# EAGLE schematic untitled (EAGLE 8.2.2)
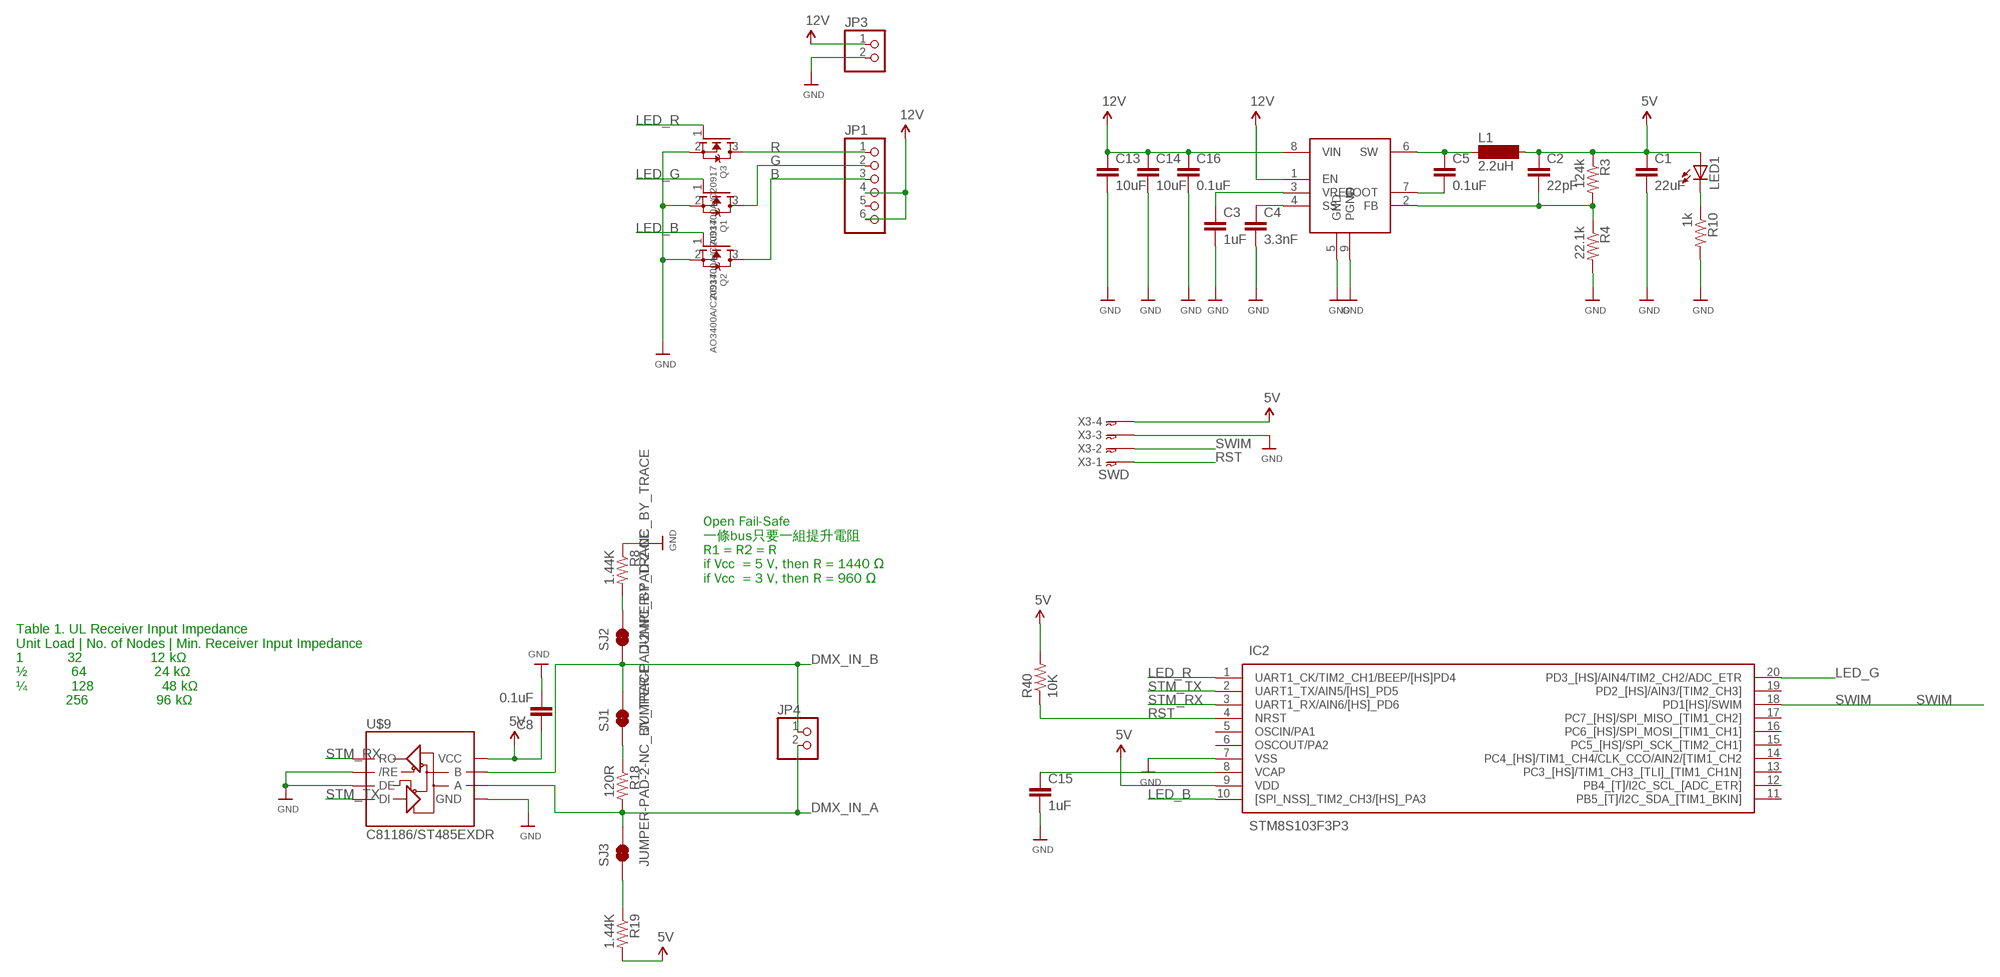
[diagram p0: schematic, sheet 1]

## Parts
C1  22uF  CAPACITOR-0805  [0805-CAP]
C2  22pF  CAPACITOR-0805  [0805-CAP]
C3  1uF  CAPACITOR-0603  [0603-CAP]
C4  3.3nF  CAPACITOR-0603  [0603-CAP]
C5  0.1uF  CAPACITOR-0603  [0603-CAP]
C8  0.1uF  CAPACITOR-0402  [0402-CAP]
C13  10uF  CAPACITOR-0603  [0603-CAP]
C14  10uF  CAPACITOR-0603  [0603-CAP]
C15  1uF  CAPACITOR-0603  [0603-CAP]
C16  0.1uF  CAPACITOR-0603  [0603-CAP]
IC2  STM8S103F3P3  [SOP65P640X120-20N]
JP1  HEADER-1X6  [1X06_OVAL]
JP3  HEADER-1X2  [1X02_OVAL]
JP4  HEADER-1X2  [1X02_OVAL]
L1  2.2uH  MS502.5X2  [MS2.5X20]
LED1  LEDCHIPLED_0603  [CHIPLED_0603]
Q1  AO3400A/C20917  MOSFET-NREFLOW  [SOT23]
Q2  AO3400A/C20917  MOSFET-NREFLOW  [SOT23]
Q3  AO3400A/C20917  MOSFET-NREFLOW  [SOT23]
R3  124k  R-US_R0603  [R0603]
R4  22.1k  R-US_R0603  [R0603]
R8  1.44K  R-US_R0603  [R0603]
R10  1k  R-US_R0603  [R0603]
R18  120R  R-US_R0603  [R0603]
R19  1.44K  R-US_R0603  [R0603]
R40  10K  R-US_R0402  [R0402]
SJ1  JUMPER-PAD-2-NC_BY_TRACE  [PAD-JUMPER-2-NC_BY_TRACE_YES_SILK]
SJ2  JUMPER-PAD-2-NC_BY_TRACE  [PAD-JUMPER-2-NC_BY_TRACE_YES_SILK]
SJ3  JUMPER-PAD-2-NC_BY_TRACE  [PAD-JUMPER-2-NC_BY_TRACE_YES_SILK]
U$1  RT7240GSP  [SO08-THERMALPAD]
U$9  C81186/ST485EXDR  RS485SOIC  [SO08]
X3  SWD  04-JST-B4B-XH-A  [B4B-XH]

## Nets
5V [5V]: C1.P$1 C2.P$1 C8.P$1 IC2.9(VDD) L1.2 LED1.A R3.1 R19.2 R40.2 U$9.8(VCC) X3.P$4
12V [12V]: C13.P$1 C14.P$1 C16.P$1 JP1.4 JP1.6 JP3.1 U$1.1(EN) U$1.8(VIN)
B [12V]: JP1.3 Q2.3(D)
DMX_IN_A [5V]: JP4.2 R18.2 SJ3.2 U$9.6(A)
DMX_IN_B [5V]: JP4.1 SJ1.2 SJ2.1 U$9.7(B)
G [12V]: JP1.2 Q1.3(D)
GND: C1.P$2 C3.P$2 C4.P$2 C8.P$2 C13.P$2 C14.P$2 C15.P$2 C16.P$2 IC2.7(VSS) JP3.2 Q1.2(S) Q2.2(S) Q3.2(S) R4.2 R8.1 R10.2 U$1.5(GND) U$1.9(PGND) U$9.2(/RE) U$9.3(DE) U$9.5(GND) X3.P$3
LED_B: IC2.10([SPI_NSS]_TIM2_CH3/[HS]_PA3) Q2.1(G)
LED_G: IC2.20(PD3_[HS]/AIN4/TIM2_CH2/ADC_ETR) Q1.1(G)
LED_R: IC2.1(UART1_CK/TIM2_CH1/BEEP/[HS]PD4) Q3.1(G)
N$1: C4.P$1 U$1.4(SS)
N$2: R19.1 SJ3.1
N$3 [5V]: C5.P$2 U$1.7(BOOT)
N$5 [5V]: R18.1 SJ1.1
N$6: LED1.C R10.1
N$7: R8.2 SJ2.2
N$18: C3.P$1 U$1.3(VREG)
N$19 [5V]: C5.P$1 L1.1 U$1.6(SW)
N$22: C2.P$2 R3.2 R4.1 U$1.2(FB)
N$41: C15.P$1 IC2.8(VCAP)
R [12V]: JP1.1 Q3.3(D)
RST: IC2.4(NRST) R40.1 X3.P$1
STM_RX: IC2.3(UART1_RX/AIN6/[HS]_PD6) U$9.1(RO)
STM_TX: IC2.2(UART1_TX/AIN5/[HS]_PD5) U$9.4(DI)
SWIM: IC2.18(PD1[HS]/SWIM) X3.P$2
Unconnected: IC2.5(OSCIN/PA1) IC2.6(OSCOUT/PA2) IC2.11(PB5_[T]/I2C_SDA_[TIM1_BKIN]) IC2.12(PB4_[T]/I2C_SCL_[ADC_ETR]) IC2.13(PC3_[HS]/TIM1_CH3_[TLI]_[TIM1_CH1N]) IC2.14(PC4_[HS]/TIM1_CH4/CLK_CCO/AIN2/[TIM1_CH2) IC2.15(PC5_[HS]/SPI_SCK_[TIM2_CH1]) IC2.16(PC6_[HS]/SPI_MOSI_[TIM1_CH1]) IC2.17(PC7_[HS]/SPI_MISO_[TIM1_CH2]) IC2.19(PD2_[HS]/AIN3/[TIM2_CH3]) JP1.5

## Notes on the sheet
- Open Fail-Safe 
  一條bus只要一組提升電阻
  R1 = R2 = R 
  if Vcc  = 5 V, then R = 1440 Ω 
  if Vcc  = 3 V, then R = 960 Ω
- Table 1. UL Receiver Input Impedance
  Unit Load | No. of Nodes | Min. Receiver Input Impedance 
  1           32                 12 kΩ
  ½           64                 24 kΩ 
  ¼           128                 48 kΩ 
  ⅛          256                 96 kΩ

## Library data of the parts
C1-C5 C8 C13-C16 = pel_dipol_comp:CAPACITOR
IC2 = SamacSys_Parts:STM8S103F3P3: STM8S103F3P3, 8 bit STM8 Microcontroller 16MHz 640 B, 8 kB Flash, 1 kB RAM, I2C 20-Pin TSSOP Source: Datasheet <https://componentsearchengine.com/Datasheets/1/STM8S103F3P3.pdf>; DESCRIPTION: STM8S103F3P3, 8 bit STM8 Microcontroller 16MHz 640 B, 8 kB Flash, 1 kB RAM, I2C 20-Pin TSSOP; HEIGHT: 1.2mm; MANUFACTURER_NAME: STMicroelectronics; MANUFACTURER_PART_NUMBER: STM8S103F3P3; MOUSER_PART_NUMBER: 511-STM8S103F3P3; MOUSER_PRICE-STOCK: https://www.mouser.com/Search/Refine.aspx?Keyword=511-STM8S103F3P3
JP1 = microbuilder:HEADER-1X6: PIN HEADER
JP3 JP4 = microbuilder:HEADER-1X2: PIN HEADER
L1 = inductor-neosid:MS50: INDUCTOR SMD power inductor
LED1 = adafruit:LED: LED OSRAM: - CHIPLED LG R971, LG N971, LY N971, LG Q971, LY Q971, LO R971, LY R971 LH N974, LH R974 LS Q976, LO Q976, LY Q976 LO Q996 - Hyper CHIPLED LW Q18S LB Q993, LB Q99A, LB R99A - SideLED LS A670, LO A670, LY A670, LG A670, LP A670 LB A673, LV A673, LT A673, LW A673 LH A674 LY A675 LS A676, LA A676, LO A676, LY A676, LW A676 LS A679, LY A679, LG A679 - Hyper Micro SIDELED® LS Y876, LA Y876, LO Y876, LY Y876 LT Y87S - SmartLED LW L88C, LW L88S LB L89C, LB L89S, LG L890 LS L89K, LO L89K, LY L89K LS L896, LA L896, LO L896, LY L896 - TOPLED LS T670, LO T670, LY T670, LG T670, LP T670 LSG T670, LSP T670, LSY T670, LOP T670, LYG T670 LG T671, LOG T671, LSG T671 LB T673, LV T673, LT T673, LW T673 LH T674 LS T676, LA T676, LO T676, LY T676, LB T676, LH T676, LSB T676, LW T676 LB T67C, LV T67C, LT T67C, LS T67K, LO T67K, LY T67K, LW E67C LS E67B, LA E67B, LO E67B, LY E67B, LB E67C, LV E67C, LT E67C LW T67C LS T679, LY T679, LG T679 LS T770, LO T770, LY T770, LG T770, LP T770 LB T773, LV T773, LT T773, LW T773 LH T774 LS E675, LA E675, LY E675, LS T675 LS T776, LA T776, LO T776, LY T776, LB T776 LHGB T686 LT T68C, LB T68C - Hyper Mini TOPLED® LB M676 - Mini TOPLED Santana® LG M470 LS M47K, LO M47K, LY M47K Source: http://www.osram.convergy.de/
Q1-Q3 = adafruit:MOSFET-N: N-Channel Mosfet 2N7002E - 60V 260mA SOT23 [Digikey: 2N7002ET1GOSTR-ND] - REEL BSH103 - 30V 850mA SOT23 [Digikey: 568-5013-1-ND]
R3 R4 R8 R10 R18 R19 R40 = resistor:R-US_: RESISTOR, American symbol
SJ1-SJ3 = SparkFun-Passives:JUMPER-PAD-2-NC_BY_TRACE
U$1 = adafruit:RT7240GSP
U$9 = SparkFun-DigitalIC:RS485: RS485 transceiver
X3 = con-jst-xh:04-JST: JST CONNECTOR

## Net classes
0 default: width 0.178 mm
1 12V: width 1.016 mm
2 5V: width 0.508 mm
3 3.3V: width 0.305 mm